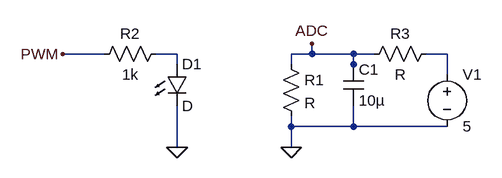
[diagram p0: schematic Draft1.asc]
Draft1.asc, the LTspice schematic file:
Version 4
SHEET 1 880 680
WIRE 0 112 -64 112
WIRE 112 112 80 112
WIRE 320 112 320 96
WIRE 320 112 288 112
WIRE 384 112 320 112
WIRE 416 112 384 112
WIRE 528 112 496 112
WIRE 112 128 112 112
WIRE 288 128 288 112
WIRE 384 128 384 112
WIRE 384 144 384 128
WIRE 528 144 528 112
WIRE 288 224 288 208
WIRE 384 224 384 192
WIRE 384 224 288 224
WIRE 528 224 384 224
WIRE 112 256 112 192
WIRE 288 256 288 224
FLAG 112 256 0
FLAG 288 256 0
FLAG -64 112 PWM
FLAG 320 96 ADC
SYMBOL LED 96 128 R0
SYMATTR InstName D1
SYMBOL res 272 112 R0
SYMATTR InstName R1
SYMBOL res 96 96 R90
WINDOW 0 0 56 VBottom 2
WINDOW 3 32 56 VTop 2
SYMATTR InstName R2
SYMATTR Value 1k
SYMBOL res 512 96 R90
WINDOW 0 0 56 VBottom 2
WINDOW 3 32 56 VTop 2
SYMATTR InstName R3
SYMBOL cap 368 128 R0
SYMATTR InstName C1
SYMATTR Value 10µ
SYMBOL voltage 528 128 R0
WINDOW 123 0 0 Left 2
WINDOW 39 0 0 Left 2
SYMATTR InstName V1
SYMATTR Value 5

The netlist it stands for:
* Draft1.asc
D1 N001 0 D
R1 ADC 0 R
R2 N001 PWM 1k
R3 N002 ADC R
C1 ADC 0 10µ
V1 N002 0 5
.model D D
.lib standard.dio
.backanno
.end